# EAGLE design rev1 (EAGLE 7.3.0)
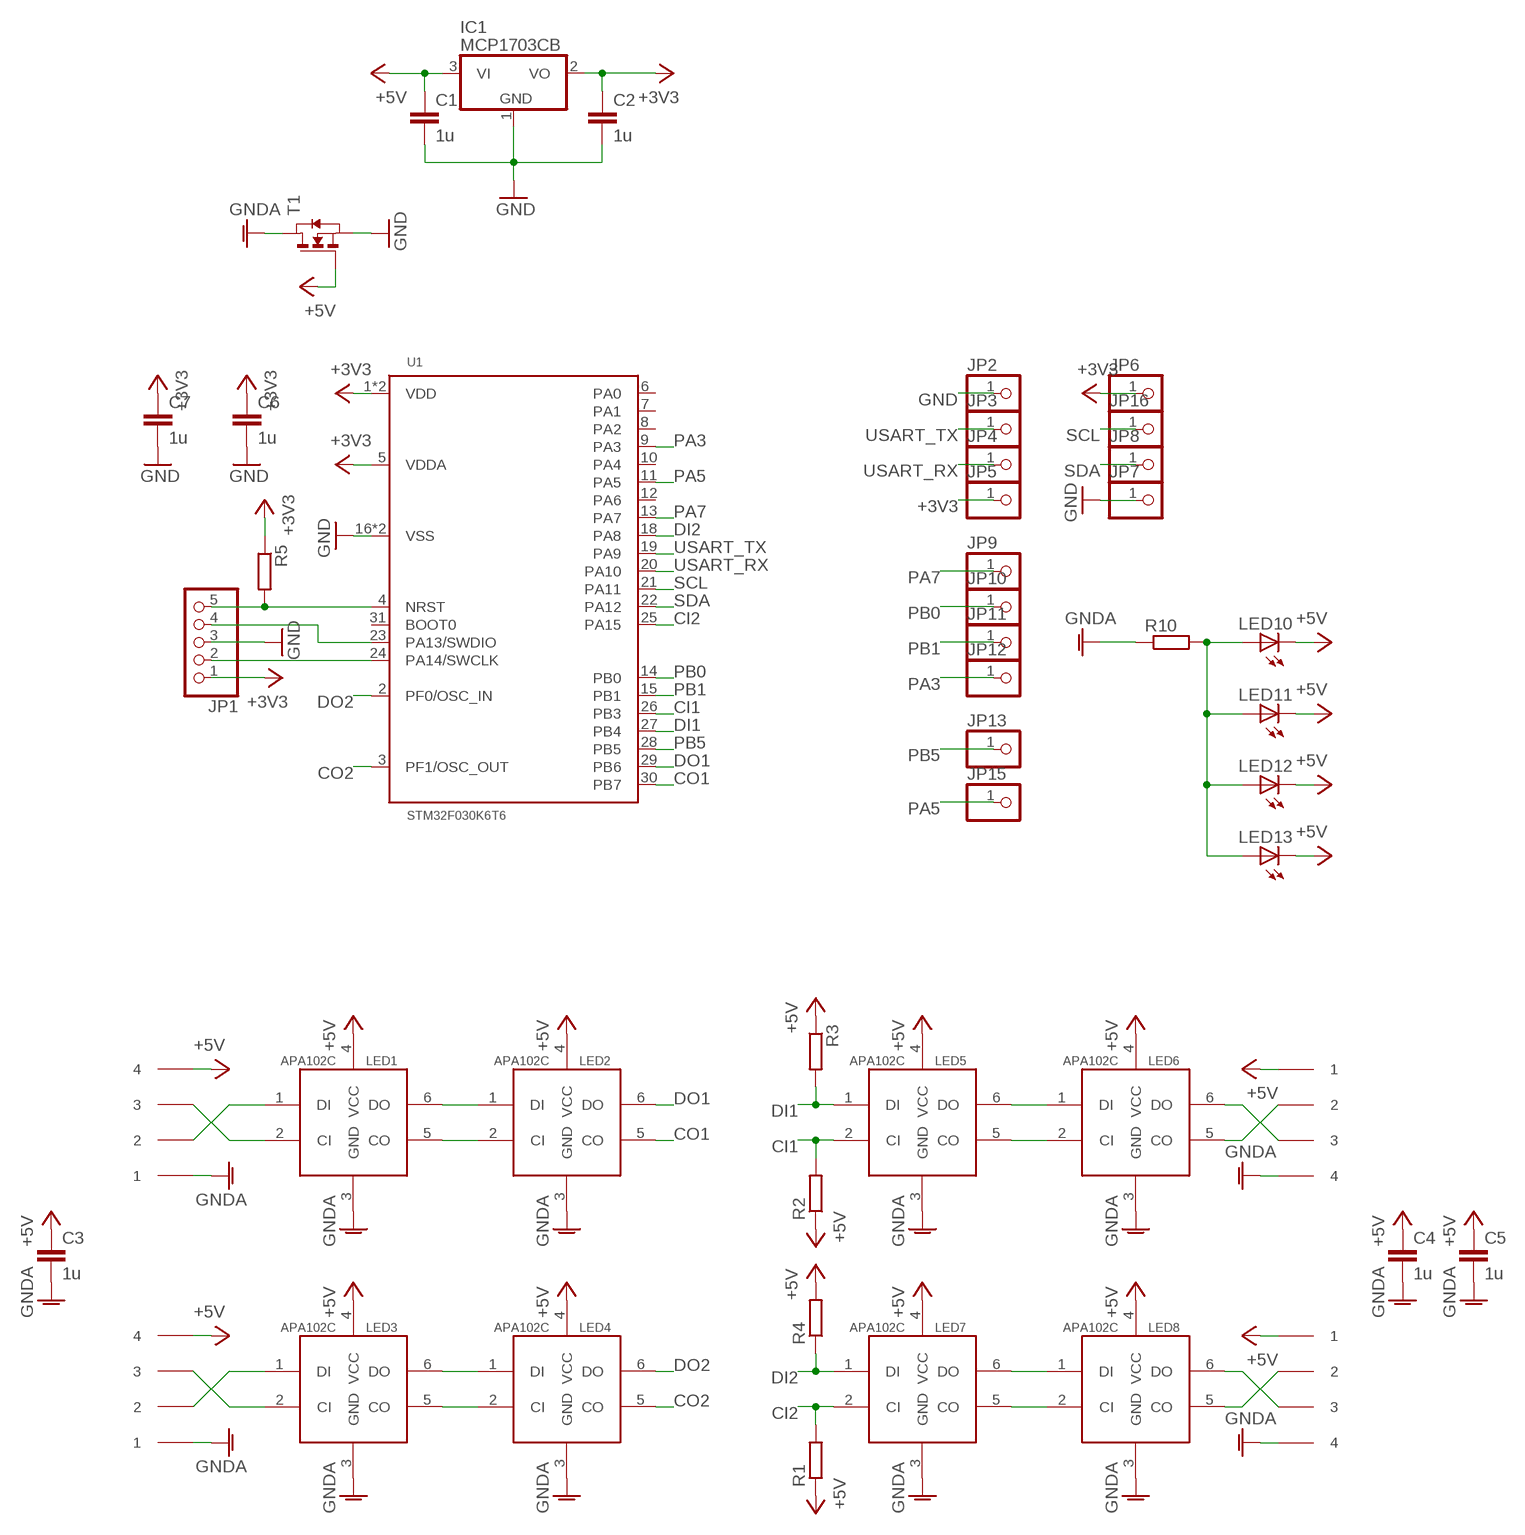
[diagram p0: schematic, sheet 1]

## Parts
C1  1u  CC0603  [C0603]
C2  1u  CC0603  [C0603]
C3  1u  CC0603  [C0603]
C4  1u  CC0603  [C0603]
C5  1u  CC0603  [C0603]
C6  1u  CC0603  [C0603]
C7  1u  CC0603  [C0603]
IC1  MCP1703CB  [SOT23]
JP1  PINHD-1X5  [1X05]
JP2  PINHD-1X1  [1X01]
JP3  PINHD-1X1  [1X01]
JP4  PINHD-1X1  [1X01]
JP5  PINHD-1X1  [1X01]
JP6  PINHD-1X1  [1X01]
JP7  PINHD-1X1  [1X01]
JP8  PINHD-1X1  [1X01]
JP9  PINHD-1X1  [1X01]
JP10  PINHD-1X1  [1X01]
JP11  PINHD-1X1  [1X01]
JP12  PINHD-1X1  [1X01]
JP13  PINHD-1X1  [1X01]
JP15  PINHD-1X1  [1X01]
JP16  PINHD-1X1  [1X01]
LED1  APA102C  [RGBLED5050]
LED2  APA102C  [RGBLED5050]
LED3  APA102C  [RGBLED5050]
LED4  APA102C  [RGBLED5050]
LED5  APA102C  [RGBLED5050]
LED6  APA102C  [RGBLED5050]
LED7  APA102C  [RGBLED5050]
LED8  APA102C  [RGBLED5050]
LED10  LEDSML0603  [SML0603]
LED11  LEDSML0603  [SML0603]
LED12  LEDSML0603  [SML0603]
LED13  LEDSML0603  [SML0603]
R1  RR0603  [R0603]
R2  RR0603  [R0603]
R3  RR0603  [R0603]
R4  RR0603  [R0603]
R5  RR0603  [R0603]
R10  RR0603  [R0603]
T1  NMOSSOT23-6  [SOT23-6]
U1  STM32F030K6T6  STM32F030K6T6-LQFP-32  [LQFP-32]
U$1  JSTPH  [JSTPH]
U$2  JSTPH  [JSTPH]
U$3  JSTPH  [JSTPH]
U$4  JSTPH  [JSTPH]

## Nets
+3V3: C2.1 C6.1 C7.1 IC1.2(VO) JP1.1 JP5.1 JP6.1 R5.1 U1.1(VDD) U1.5(VDDA) U1.17(VDD)
+5V: C1.1 C3.1 C4.1 C5.1 IC1.3(VI) LED1.4(VCC) LED2.4(VCC) LED3.4(VCC) LED4.4(VCC) LED5.4(VCC) LED6.4(VCC) LED7.4(VCC) LED8.4(VCC) LED10.C LED11.C LED12.C LED13.C R1.1 R2.1 R3.1 R4.2 T1.3(G) U$1.P$4 U$2.P$4 U$3.1 U$4.1
CI1: LED5.2(CI) R2.2 U1.26(PB3)
CI2: LED7.2(CI) R1.2 U1.25(PA15)
CI-CON1: LED1.2(CI) U$1.P$3
CI-CON2: LED3.2(CI) U$2.P$3
CO1: LED2.5(CO) U1.30(PB7)
CO2: LED4.5(CO) U1.3(PF1/OSC_OUT)
DI1: LED5.1(DI) R3.2 U1.27(PB4)
DI2: LED7.1(DI) R4.1 U1.18(PA8)
DI-CON1: LED1.1(DI) U$1.P$2
DI-CON2: LED3.1(DI) U$2.P$2
DO1: LED2.6(DO) U1.29(PB6)
DO2: LED4.6(DO) U1.2(PF0/OSC_IN)
GND: C1.2 C2.2 C6.2 C7.2 IC1.1(GND) JP1.3 JP2.1 JP7.1 T1.4(S) U1.16(VSS) U1.32(VSS)
GNDA: C3.2 C4.2 C5.2 LED1.3(GND) LED2.3(GND) LED3.3(GND) LED4.3(GND) LED5.3(GND) LED6.3(GND) LED7.3(GND) LED8.3(GND) R10.1 T1.1(D) T1.2(D) T1.5(D) T1.6(D) U$1.1 U$2.1 U$3.P$4 U$4.P$4
N$1: LED7.6(DO) LED8.1(DI)
N$2: LED7.5(CO) LED8.2(CI)
N$3: LED1.6(DO) LED2.1(DI)
N$4: LED1.5(CO) LED2.2(CI)
N$5: LED3.5(CO) LED4.2(CI)
N$6: LED3.6(DO) LED4.1(DI)
N$7: LED5.6(DO) LED6.1(DI)
N$8: LED5.5(CO) LED6.2(CI)
N$13: LED6.6(DO) U$4.P$3
N$14: LED6.5(CO) U$4.P$2
N$15: LED8.6(DO) U$3.P$3
N$16: LED8.5(CO) U$3.P$2
N$24: LED10.A LED11.A LED12.A LED13.A R10.2
NRST: JP1.5 R5.2 U1.4(NRST)
PA3: JP12.1 U1.9(PA3)
PA5: JP15.1 U1.11(PA5)
PA7: JP9.1 U1.13(PA7)
PB0: JP10.1 U1.14(PB0)
PB1: JP11.1 U1.15(PB1)
PB5: JP13.1 U1.28(PB5)
SCL: JP16.1 U1.21(PA11)
SDA: JP8.1 U1.22(PA12)
SWCLOCK: JP1.2 U1.24(PA14/SWCLK)
SWDIO: JP1.4 U1.23(PA13/SWDIO)
USART_RX: JP4.1 U1.20(PA10)
USART_TX: JP3.1 U1.19(PA9)
Unconnected: U1.6(PA0) U1.7(PA1) U1.8(PA2) U1.10(PA4) U1.12(PA6) U1.31(BOOT0)

## Library data of the parts
C1-C7 = eagle-ltspice:C: CAPACITOR, European symbol; SPICEMODEL: NONE; SPICEPREFIX: C
IC1 = linear:MCP1703: 250 mA, 16V, Low Quiescent Current LDO Regulator Source: http://ww1.microchip.com/downloads/en/DeviceDoc/22049b.pdf
JP1 = pinhead:PINHD-1X5: PIN HEADER
JP2-JP13 JP15 JP16 = pinhead:PINHD-1X1: PIN HEADER
LED1-LED8 = apa102c:APA102C
LED10-LED13 = led:LED: LED OSRAM: - CHIPLED LG R971, LG N971, LY N971, LG Q971, LY Q971, LO R971, LY R971 LH N974, LH R974 LS Q976, LO Q976, LY Q976 LO Q996 - Hyper CHIPLED LW Q18S LB Q993, LB Q99A, LB R99A - SideLED LS A670, LO A670, LY A670, LG A670, LP A670 LB A673, LV A673, LT A673, LW A673 LH A674 LY A675 LS A676, LA A676, LO A676, LY A676, LW A676 LS A679, LY A679, LG A679 - Hyper Micro SIDELED® LS Y876, LA Y876, LO Y876, LY Y876 LT Y87S - SmartLED LW L88C, LW L88S LB L89C, LB L89S, LG L890 LS L89K, LO L89K, LY L89K LS L896, LA L896, LO L896, LY L896 - TOPLED LS T670, LO T670, LY T670, LG T670, LP T670 LSG T670, LSP T670, LSY T670, LOP T670, LYG T670 LG T671, LOG T671, LSG T671 LB T673, LV T673, LT T673, LW T673 LH T674 LS T676, LA T676, LO T676, LY T676, LB T676, LH T676, LSB T676, LW T676 LB T67C, LV T67C, LT T67C, LS T67K, LO T67K, LY T67K, LW E67C LS E67B, LA E67B, LO E67B, LY E67B, LB E67C, LV E67C, LT E67C LW T67C LS T679, LY T679, LG T679 LS T770, LO T770, LY T770, LG T770, LP T770 LB T773, LV T773, LT T773, LW T773 LH T774 LS E675, LA E675, LY E675, LS T675 LS T776, LA T776, LO T776, LY T776, LB T776 LHGB T686 LT T68C, LB T68C - Hyper Mini TOPLED® LB M676 - Mini TOPLED Santana® LG M470 LS M47K, LO M47K, LY M47K Source: http://www.osram.convergy.de LUXEON: - LUMILED® LXK2-PW12-R00, LXK2-PW12-S00, LXK2-PW14-U00, LXK2-PW14-V00 LXK2-PM12-R00, LXK2-PM12-S00, LXK2-PM14-U00 LXK2-PE12-Q00, LXK2-PE12-R00, LXK2-PE12-S00, LXK2-PE14-T00, LXK2-PE14-U00 LXK2-PB12-K00, LXK2-PB12-L00, LXK2-PB12-M00, LXK2-PB14-N00, LXK2-PB14-P00, LXK2-PB14-Q00 LXK2-PR12-L00, LXK2-PR12-M00, LXK2-PR14-Q00, LXK2-PR14-R00 LXK2-PD12-Q00, LXK2-PD12-R00, LXK2-PD12-S00 LXK2-PH12-R00, LXK2-PH12-S00 LXK2-PL12-P00, LXK2-PL12-Q00, LXK2-PL12-R00 Source: www.luxeon.com KINGBRIGHT: KA-3528ASYC Source: www.kingbright.com
R1-R5 R10 = eagle-ltspice:R: RESISTOR, European symbol; SPICEMODEL: NONE; SPICEPREFIX: R
T1 = zetex:NMOSSOT23-6: MOS FET; OC_FARNELL: unknown; OC_NEWARK: unknown
U1 = STM32F030K6T6:STM32F030K6T6
U$1-U$4 = jst:JSTPH

## Board
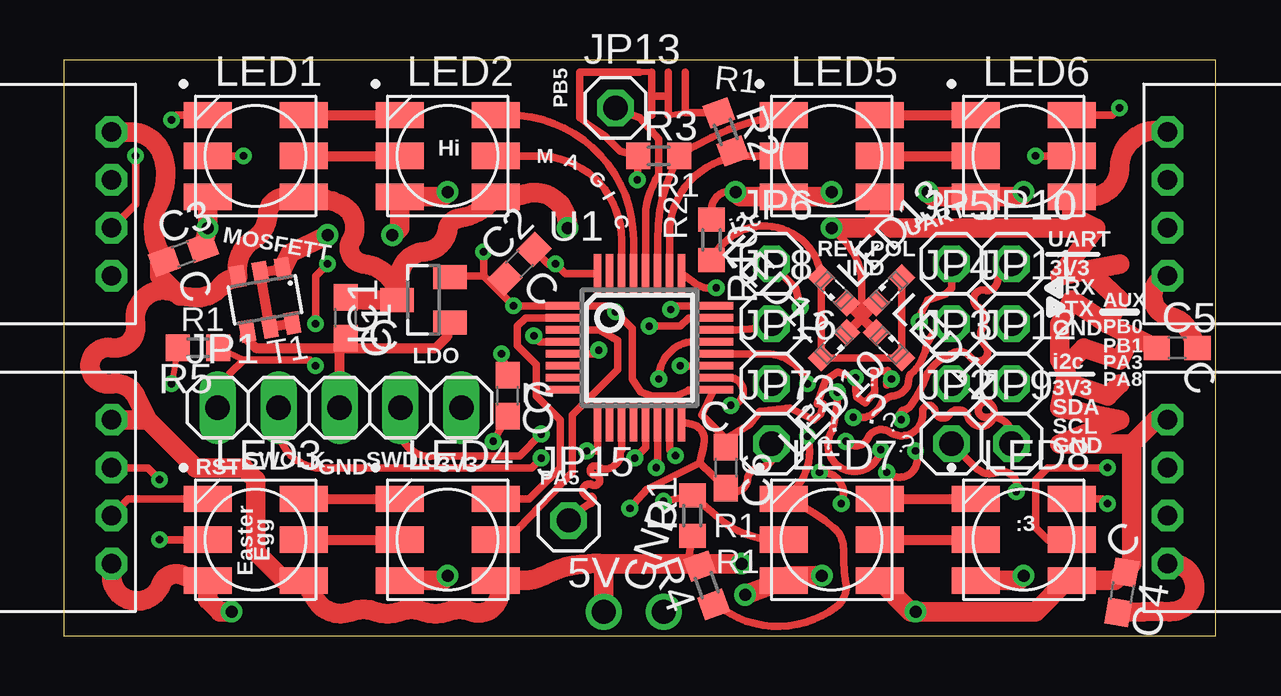
[diagram p1: board, top side]
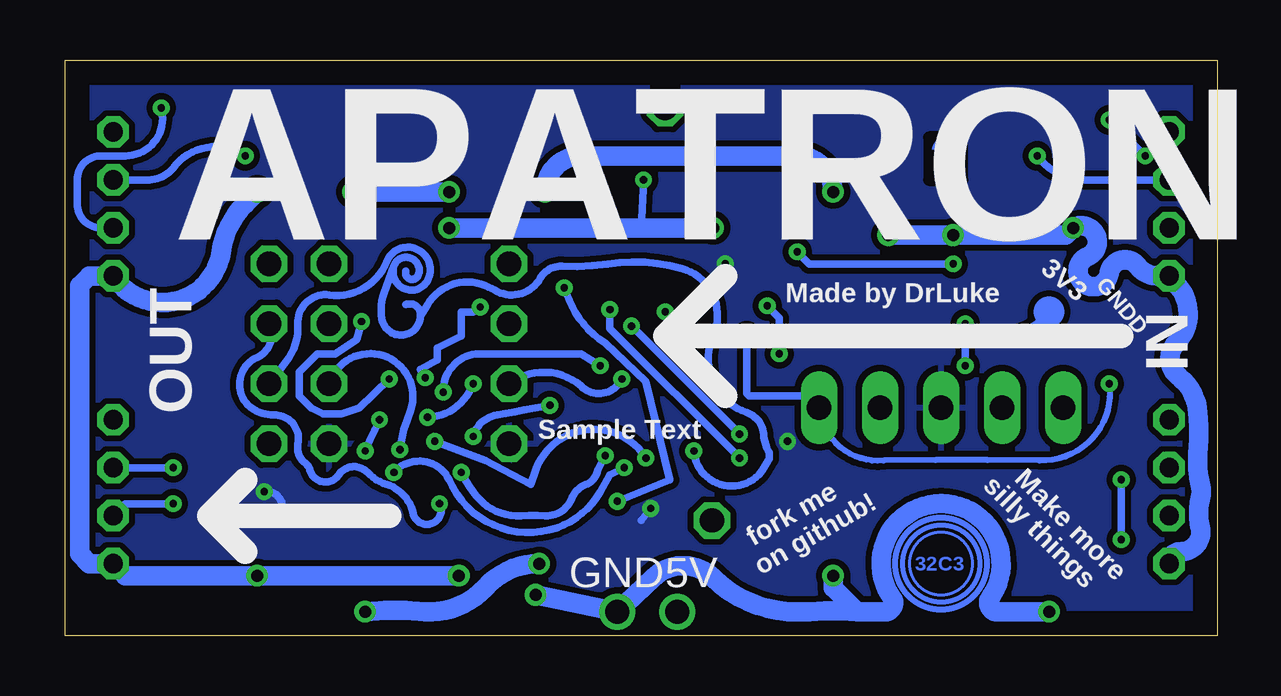
[diagram p2: board, bottom side, seen from below]

Size 48 x 24 mm. Coordinates in mm from the lower left corner, seen from the top.
Outline: 0,0 48,0 48,24 0,24 0,0
Copper layers (1*16): Top 0.035mm / dielectric 1.5mm / Bottom 0.035mm
Design rules "default": minimum track width 10mil, minimum drill 24mil, track to track 8mil, track to pad 8mil, pad to pad 8mil, via to via 8mil, smd to smd 8mil, copper to edge 40mil, drill to drill 8mil, minimum pad ring 10mil, minimum via ring 8mil, stop-mask expansion 4mil, vias tented up to drill 0mil, thermal gap 10mil

### Footprints (pad centres in the part's own frame; a part is rotated, then mirrored left to right if it is on the bottom)
C0603 = smd 1.1 x 1: 1 -0.85,0; 2 0.85,0
SOT23 = smd 1 x 1.4: 1 -0.95,-1.1; 2 0.95,-1.1; 3 0,1.1
1X05 = drill 1.016 long: 1 -5.08,0; 2 -2.54,0; 3 0,0; 4 2.54,0; 5 5.08,0
1X01 = drill 1.016 octagon: 1 0,0
RGBLED5050 = smd 2 x 1.1: 1 -2,1.7; 2 -2,0; 3 -2,-1.7; 4 2,-1.7; 5 2,0; 6 2,1.7
SML0603 = smd 0.8 x 0.8: A 0.75,0; C -0.75,0
R0603 = smd 1 x 1.1: 1 -0.85,0; 2 0.85,0
SOT23-6 = smd 0.6 x 0.9: 1 -0.95,-1.15; 2 0,-1.15; 3 0.95,-1.15; 4 0.95,1.15; 5 0,1.15; 6 -0.95,1.15
LQFP-32 = smd 0.3 x 1.6: 1 -1.75,-3.1; 2 -1.25,-3.1; 3 -0.75,-3.1; 4 -0.25,-3.1; 5 0.25,-3.1; 6 0.75,-3.1; 7 1.25,-3.1; 8 1.75,-3.1; 17 1.75,3.1; 18 1.25,3.1; 19 0.75,3.1; 20 0.25,3.1; 21 -0.25,3.1; 22 -0.75,3.1; 23 -1.25,3.1; 24 -1.75,3.1 | smd 1.6 x 0.3: 9 3.1,-1.75; 10 3.1,-1.25; 11 3.1,-0.75; 12 3.1,-0.25; 13 3.1,0.25; 14 3.1,0.75; 15 3.1,1.25; 16 3.1,1.75; 25 -3.1,1.75; 26 -3.1,1.25; 27 -3.1,0.75; 28 -3.1,0.25; 29 -3.1,-0.25; 30 -3.1,-0.75; 31 -3.1,-1.25; 32 -3.1,-1.75
JSTPH = drill 0.8 octagon: 1 -3,0; P$2 -1,0; P$3 1,0; P$4 3,0

### Placement (x,y rotation side)
C1  11.75,13.25 270 top
C2  19,15.5 45 top
C3  5,15.9 20 top
C4  44.1,1.8 260 top
C5  46.4,12 0 top
C6  27.6,7 270 top
C7  18.5,10 270 top
IC1  15,14 90 top
JP1  11.5,9.5 0 top
JP2  37,8 0 top
JP3  37,10.5 0 top
JP4  37,13 0 top
JP5  37,15.5 0 top
JP6  29.5,15.5 0 top
JP7  29.5,8 0 top
JP8  29.5,13 0 top
JP9  39.5,8 0 top
JP10  39.5,15.5 0 top
JP11  39.5,13 0 top
JP12  39.5,10.5 0 top
JP13  23,22 0 top
JP15  21.05,4.8 0 top
JP16  29.5,10.5 0 top
LED1  8,20 0 top
LED2  16,20 0 top
LED3  8,4 0 top
LED4  16,4 0 top
LED5  32,20 0 top
LED6  40,20 0 top
LED7  32,4 0 top
LED8  40,4 0 top
LED10  32.1,12.1 225 top
LED11  34.4,12.1 315 top
LED12  32.1,14.4 135 top
LED13  34.4,14.4 45 top
R1  26.2,5 90 top
R2  27.6,21 290 top
R3  24.8,20 0 top
R4  26.8,2.1 110 top
R5  5.6,12 180 top
R10  27,16.5 270 top
T1  8.4,14 190 top
U1  24,12 270 top
U$1  2,18 90 top
U$2  2,6 90 top
U$3  46,6 270 top
U$4  46,18 270 top

### Tracks (layer width: path | path; a pad name or v marks a point on that pad's centre or on a via)
+3V3  (via drill 0.3)
  Top 0.254: R5.1 7.5,11.5
  Top 0.305: IC1.2 16.15,15 17.5,15 | 17.5,15 18,14.5 | 18,14.5 v18.75,13.75 U1.1 22.75,13.75 v23,13.5 23.7,12.8 23.7,10.7 24.05,10.15 24.5,10 25.5,10 26,10.2 26.05,10.25 U1.17 26.6,9.2 27.6,8.2 | C2.1 18,14.5 | JP1.1 6.92,10.92 7.5,11.5 10.25,11.5 v10.5,11.25 | v10.5,13 10.5,15 v11,15.5 | v17.5,16 17.5,15 | v34.5,10.7 34.3,10.45 34.35,11.05 33.75,11 33.8,10.15 33.4,9.7 33.05,9.95 33,10.25 v33,10.75 32.25,11 31.75,10.65 31.4,9.65 31.65,9.65 31.55,9.25 31.25,9 30.25,9.5 29,9.35 28.6,8.8 27.6,8.2 | v35.65,13.1 35.75,13.5 36,14 36.75,14.25 37,14.5 JP5.1 | C6.1 27.6,8.2 | v30.7,13.7 30.5,14.5 JP6.1 | C7.1 v18.25,11.75 | U1.5 22.15,11.75 v22.3,11.9
  Bottom 0.305: v18.25,11.75 18.25,13.25 v18.75,13.75 | v10.5,11.25 10.5,12.5 | 10.5,12.5 v10.5,13 | v11,15.5 17,15.5 v17.5,16 | v34.5,10.7 35.75,9.5 36.5,9.25 37.25,9.25 37.75,9.5 38.25,10 38.25,11 37.5,11.75 36.75,11.75 35.85,12.35 v35.65,13.1 | v33,10.75 33.2,11.1 32.5,11.5 32.5,12 31.5,12.5 31.5,13.5 31,13.5 v30.7,13.7 | v22.3,11.9 22.3,12.8 v23,13.5 | 10.5,12.5 9,12.5 arc-53 7,13.5
+5V  (via drill 0.3, 0.5, 1)
  Top 0.254: 25.2,21.7 25.9,21.8 | 24.5,23.5 24,23.5
  Top 0.305: C1.1 12,14.5 | C3.1 4,16 | v32,17 32.5,16.5 arc-49 33.25,14.5 33.25,13.25 | R4.2 24,3 | v23.9,19 R3.1 23.2,20.2 22.6,20.8 22,21.2 21.5,21.6 21.5,23.5 24,23.5 | 24.5,23.5 24.5,22.5 | 24.5,22.5 24.5,21.7 | 24.5,22.5 25.2,22.5 | 25.2,22.5 25.2,23.5 | 25.9,23.5 25.9,21.8 R2.1 | 25.2,22.5 25.2,21.7 | R1.1 26,3
  Top 0.406: LED10.C 33.25,13.25 | 33.25,13.25 LED12.C | LED11.C 33.25,13.25 | 33.25,13.25 | 33.25,13.25 LED13.C
  Top 0.813: 4.75,14.25 4.85,14.15 5.5,14.1 arc52 6.5,14.5 arc-43 7.1,14.9 | 4.75,14.25 4,15 4,16 | 17.8,2.3 LED4.4 | LED7.4 35.3,1 v35.5,1 40.5,1 41.8,2.3 LED8.4 43.8,2.3 44,2.5 | 44,2.5 44.5,3 44.5,8 | 44.5,8 45.5,9 U$3.1 | U$2.P$4 3.5,9 | 3.5,9 5.5,7 7.5,7 8,6.5 8,3.5 9.2,2.3 LED3.4 10.5,1.5 arc79 12,1 arc-42 13,1 arc42 14,1 arc-42 15,1 arc42 16,1 arc-42 17,1 arc147 LED4.4 | LED5.4 34,17.5 | 34,17.5 34.5,17 43,17 | 43,17 42,17.5 LED6.4 42.8,18.3 arc90 44,19.5 arc-106 U$4.1 | v32,17 33.5,17 34,17.5 | 22.5,3 24,3 26,3 v28.25,3 | IC1.3 12.5,14 arc-15 C1.1 | IC1.3 14,14 arc77 12.5,15.5 arc-114 12,16.5 arc98 11.5,18 arc23 LED1.4 9.3,18.3 arc90 8.5,17.5 arc-53 7.9,16.5 arc69 T1.3 | v22.5,1 22.5,3 | C4.1 44,2.5 | IC1.3 14,15 arc-79 15,16 arc79 16,16.9 arc-79 16.5,17.4 arc45 LED2.4 18.6,18.3 arc19 19.2,18.4 arc-114 v21,17 | U$1.P$4 2.8,21 arc-69 4.1,20.1 arc-47 4,18.1 arc62 C3.1 | 3.5,9 3,10 arc74 2,10.5 arc-201 2,12 arc111 3,13 arc-130 4.75,14.25 | LED4.4 19.2,2.3 arc28 20,2.5 arc-27 21.9,3 arc-3 22.5,3 | 43,17 41.5,15 42.68,15.23 | 42.68,15.23 44,15.5 | 42.68,15.23 44,14 43.5,13 | 43.5,13 42,14 41.5,13 41.5,11.5 41.8,10.9 | 43.5,13 44.5,12.5 | 44.5,12.5 C5.1 | 44.5,12.5 44,11.5 42.5,12 42,11.5 | 41.8,10.9 42,10.5 43.5,10 44,10.5 | 44.5,8 41.5,8 44,9 41.5,9.5 41.8,10.9
  Bottom 0.305: v23.9,19 24,17
  Bottom 0.813: v21,17 24,17 v32,17 | v28.25,3 arc-48 30.5,2 arc52 33,1 arc-9 v35.5,1
CI1
  Top 0.305: U1.26 25.25,16.75 arc-90 28.5,20 | LED5.2 28.5,20 | R2.2 28.5,20
CI2  (via drill 0.3)
  Top 0.305: U1.25 26.3,14.7 arc47 v27.2,14.5 | v25,5.6 R1.2 27.3,4.9 arc45 LED7.2
  Bottom 0.305: v27.2,14.5 27,14 arc-36 25.5,12.2 23.8,10.6 22.8,6.5 v25,5.6
CI-CON1  (via drill 0.3)
  Top 0.305: v7.5,20 LED1.2
  Bottom 0.305: U$1.P$3 5.5,19 arc53 v7.5,20
CI-CON2  (via drill 0.3)
  Top 0.305: U$2.P$3 3.5,7 v4,6.5 | v4,4 LED3.2
  Bottom 0.305: v4,6.5 v4,4
CO1
  Top 0.305: U1.30 23.25,16.5 arc90 19.75,20 LED2.5
CO2
  Top 0.305: LED4.5 18.5,4 21.2,6.8 21.2,9.2 23.1,11.1 23.1,12.3 22.35,12.75 U1.3
DI1
  Top 0.305: U1.27 24.75,16.5 arc-29 R3.2 arc-10 26.3,20.4 arc-22 29.95,21.7 LED5.1
DI2  (via drill 0.3)
  Top 0.305: U1.18 27.8,10.75 arc-170 v27.8,9.6 | v31,8.3 arc-73 LED7.1 arc-23 32.1,4.5 arc-50 32.5,3.6 arc10 32.6,2.2 arc-62 32.2,1.2 arc-67 27.8,0.9 R4.1
  Bottom 0.305: v27.8,9.6 28.9,9.4 arc2 30,9.2 arc-65 v31,8.3
DI-CON1  (via drill 0.3)
  Top 0.305: U$1.P$2 3,18 v3,20 | v4.5,21.5 4.7,21.7 LED1.1
  Bottom 0.305: v3,20 v4.5,21.5
DI-CON2
  Top 0.305: U$2.P$2 2.7,5.7 LED3.1
DO1
  Top 0.305: U1.29 23.75,16.5 arc90 18.55,21.7 LED2.6
DO2
  Top 0.305: LED4.6 19.4,5.7 20.7,7 20.7,9 19.7,10 19.7,11.3 18.9,12.1 18.9,12.9 19.25,13.25 U1.2
GND  (via drill 0.3)
  Top 0.305: 11.75,12 11.5,12 11.75,12.25 C1.2 | IC1.1 16.15,13 | C2.2 20.2,15.5 v20.5,15.5 20.9,15.1 U1.32 | 26.5,7.2 C6.2 arc130 28.5,6.5 arc-82 29,7 arc119 JP7.1 | C7.2 v17.9,8.1 | U1.16 26.2,8.8 arc-84 26.7,8.1 arc-8 26.5,7.2 | 26.5,7.2 24.3,6.1 v23.6,5.3 | JP2.1 38,7 arc65 38.9,6.8 arc-130 v39.7,6
  Top 0.406: T1.4 7.55,12.45 8,12 11.5,12 | 11.5,12 15.5,12 16,12.5 16,12.95 IC1.1 | JP1.3 11.5,12
  Bottom 0.305: v23.6,5.3 24,4.8 | 39.6,4.7 arc-189 v39.7,6
  pour Bottom (isolate 0.254): 0,24 48,24 48,0 0,0
GNDA  (via drill 0.5, 1)
  Top 0.305: R10.1 27,17.75 arc-106 v28,18.5
  Top 0.406: T1.1 T1.2 T1.5 T1.6
  Top 0.813: T1.1 9.45,15.95 v11,16.7 | v13.7,16.7 14,17 LED2.3 15.8,18.3 v16,18.5 | v16,2.5 15.8,2.3 LED4.3 | v40,2.5 39.8,2.3 LED8.3 | v31.6,2.5 30.2,2.5 LED7.3 v28.4,1.7 | LED3.3 6,2 | 6,2 6,1.5 6.5,1 v7,1 | v36,18.5 36.2,18.3 LED6.3 39.8,18.3 arc90 v40,18.5 | v32,18.5 31.8,18.3 LED5.3 28.2,18.3 v28,18.5 | LED1.3 v6,17 C3.2 | C4.2 45,1 arc-4 46.1,1 arc190 U$3.P$4 | C5.2 46.9,12.7 arc53 46.1,13.3 arc-153 U$4.P$4 | U$2.1 2,2.5 arc152 4,2 4.1,2.2 arc-90 5,2.5 6,2
  Bottom 0.813: v13.7,16.7 v11,16.7 6.3,16.7 v6,17 arc187 5.4,15.8 arc-238 4.5,15.1 arc134 3.3,15.4 arc-53 2.5,15 U$1.1 | v31.6,2.5 v40,2.5 45.5,2.5 U$3.P$4 47,3 47.4,3.4 47.4,14.6 47,15 U$4.P$4 arc-139 41.5,16 arc37 40.5,18 v40,18.5 | 15,1 16,2 v16,2.5 | v36,18.5 v32,18.5 | v28.4,1.7 v25,1 23.5,2.4 arc90 21,2.4 arc-49 17,1 arc8 15,1 | v7,1 9,1 arc127 9.5,1.5 arc-254 13.5,1.5 arc127 14,1 15,1 | U$2.1 arc90 1.5,3.5 arc-103 0.7,4.5 arc25 0.7,5.7 arc-25 0.7,6.3 arc17 0.8,7.6 arc-8 0.8,9.3 arc-48 1.6,10.8 arc96 1.7,12.2 arc-101 2,14.9 | v16,18.5 arc-90 17.5,20 26.5,20 arc-90 v28,18.5
N$1
  Top 0.406: LED7.6 LED8.1
N$2
  Top 0.406: LED7.5 LED8.2
N$3
  Top 0.406: LED1.6 LED2.1
N$4
  Top 0.406: LED1.5 LED2.2
N$5
  Top 0.406: LED3.5 LED4.2
N$6
  Top 0.406: LED3.6 LED4.1
N$7
  Top 0.406: LED5.6 LED6.1
N$8
  Top 0.406: LED5.5 LED6.2
N$13  (via drill 0.3)
  Top 0.305: LED6.6 43.7,21.7 v44,22
  Bottom 0.305: U$4.P$3 46.5,17 arc90 47.5,18 47.5,19 arc90 46.5,20 45.5,20 arc-106 v44,22
N$14  (via drill 0.3)
  Top 0.305: LED6.5 v40.5,20
  Bottom 0.305: U$4.P$2 44.5,19 arc-53 43.5,19.5 arc87 v40.5,20
N$15  (via drill 0.3)
  Top 0.305: LED8.6 43.3,5.7 v43.5,5.5
  Bottom 0.305: v43.5,5.5 45.5,5.5 U$3.P$3
N$16  (via drill 0.3)
  Top 0.305: LED8.5 41,4 40.5,4.5 40.5,6.5 41,7 v43.5,7
  Bottom 0.305: v43.5,7 U$3.P$2
N$24
  Top 0.305: R10.2 arc-34 28,16.75 arc-115 LED12.A LED10.A LED11.A LED13.A
NRST  (via drill 0.3)
  Top 0.254: R5.2 v4.5,10.5
  Top 0.305: U1.4 19.85,12.25 v19.6,12.5
  Bottom 0.254: v4.5,10.5 arc100 7.4,7.3 arc-1 13.9,7.3 arc90 JP1.5
  Bottom 0.305: v19.6,12.5 19.6,10.1 19.5,10 17.08,10 JP1.5
PA3  (via drill 0.3)
  Top 0.305: v21.8,7.7 22.25,7.7 U1.9
  Bottom 0.305: JP12.1 38.8,11.4 arc-41 38.3,13 arc101 37,14.2 arc-76 34.6,15.6 arc187 32.9,14.8 arc169 34.3,15.4 | 34.3,15.4 arc188 33.3,15 arc172 33.8,15.2 | 34.3,15.4 34.7,14.3 arc-30 34.8,13.2 arc-168 33.2,13.3 | 33.2,13.3 32.9,13.8 arc81 30.5,14.6 arc9 30.1,14.4 arc-91 28.2,14.9 arc63 27.3,15.4 arc-11 25.4,15.5 arc24 22.3,15.3 arc99 21,12.5 arc-96 19.6,9.3 arc68 18.9,8.4 arc-24 18.7,7.7 arc56 18.7,7.3 arc12 19.1,6.7 arc131 v21.8,7.7 | 33.2,13.3 33.2,13.4 arc-113 33.8,13.8
PA5
  Top 0.305: JP15.1 arc-12 21.9,5.5 arc149 22,5.8 arc-221 22,6.3 arc221 22.1,6.7 arc-221 22.3,7 arc122 23.2,7.7 23.25,7.75 U1.11
PA7  (via drill 0.3)
  Top 0.305: v32.6,8.1 arc110 33.5,8.2 arc-100 34.4,8.5 arc132 35.8,9.3 arc-179 36.3,9.4 arc49 36.5,9.1 arc86 36.9,9.2 arc-133 37.7,9.1 arc209 38.6,9.7 arc221 38.5,9.1 arc-117 JP9.1 | v23.8,7.4 24.25,7.85 U1.13
  Bottom 0.305: v32.6,8.1 30.5,7.3 28.6,6.3 28.4,6.9 arc128 v23.8,7.4
PB0  (via drill 0.3)
  Top 0.305: v34.3,6.8 arc159 v35.5,7.7 | v34.9,9 arc-104 35,9.4 arc51 35.3,9.6 35.5,9.9 arc14 35.9,10.7 arc-29 36.3,11.3 arc-20 37.1,11.8 arc-76 37.8,11.6 arc187 38.4,12.1 arc-73 38.3,12.9 arc86 38.1,13.7 arc-161 38.4,14.4 arc89 38.9,14.7 arc-45 JP10.1 | U1.14 24.75,7.05 v24.7,7
  Bottom 0.305: v24.7,7 25.3,6.7 25.7,6 arc41 27.5,4.5 arc87 32,6.5 arc-112 v34.3,6.8 | v35.5,7.7 arc1 v34.9,9
PB1  (via drill 0.3)
  Top 0.305: v31.5,6.8 arc-125 v32.4,5.5 | U1.15 25.25,7.75 v25.5,7.5
  Bottom 0.305: v25.5,7.5 25.8,6.9 arc57 26.3,6.3 arc-47 26.9,5.7 arc72 28,5 arc-7 29,5 arc60 31,6 arc3 v31.5,6.8 | v32.4,5.5 arc196 33.5,5.1 arc-61 34.6,6.3 arc30 35.4,6.8 arc-103 36.6,6.7 arc132 37.8,6.9 arc-38 38,7.2 arc64 38.3,8 arc-103 39.3,9.2 arc31 40.1,9.4 arc127 40,11.6 arc-92 JP11.1
PB5
  Top 0.305: U1.28 24.25,17.5 arc-32 24.8,19.2 24.8,20.7 24,21.6 arc-11 JP13.1
SCL  (via drill 0.3)
  Top 0.305: U1.21 26.1,12.25 arc80 v24.8,10.7
  Bottom 0.305: JP16.1 arc77 26.5,10.4 arc-109 v24.8,10.7
SDA
  Top 0.305: U1.22 28,12.75 arc19 JP8.1
SWCLOCK  (via drill 0.3)
  Top 0.305: JP1.2 8.96,8.54 arc90 11,7 19.5,7 v19.9,7.4 | v25.3,13.6 25.45,13.75 U1.24
  Bottom 0.305: v19.9,7.4 25.3,12.8 v25.3,13.6
SWDIO  (via drill 0.3)
  Top 0.305: JP1.4 14.04,8.46 arc90 15.5,7.5 19,7.5 v19.9,8.4 | v24.4,12.9 25.7,12.9 26.05,13.25 U1.23
  Bottom 0.305: v19.9,8.4 v24.4,12.9
USART_RX  (via drill 0.3)
  Top 0.305: U1.20 29.25,11.75 arc-71 v31,10.5 | JP4.1 arc73 35.9,11.85 arc-34 35.3,10.9 arc29 35.2,10.5 arc-65 34.6,10 arc44 34.1,9.7 arc-53 33.4,9.1 v32.9,9.1
  Bottom 0.305: v31,10.5 arc68 v32.9,9.1
USART_TX  (via drill 0.3)
  Top 0.305: U1.19 v25.7,11.25 | v32.25,10.15 arc-16 32,8.5 arc200 v34.05,7.75
  Bottom 0.305: v25.7,11.25 26.5,11.75 30.75,11.75 arc-90 v32.25,10.15 | v34.05,7.75 arc15 33.6,9.4 arc-181 JP3.1
(copper drawn outside any net)
  shapes: Bottom circle x4

### Text on the board
Bottom: ? | 32C3
tPlace: R1 | PB5 | Hi | M | A | G | R1 | I | C | i2c | UART | MOSFETT | R2 | REV.POL | UART | IND | 3V3 | C | R1 | C | RX | AUX | TX | PB0 | C | LDO | GND | PB1 | i2c | PA3 | C | ? | ? | 3V3 | PA8 | C | ? | ? | SDA | C | ? | ? | ? | GND | SCL | RST | SWCLK | GND | SWDIO | 3V3 | PA5 | ? | R1 | :3 | C | R1 | Egg | Easter | 5V | GND
bPlace: APATRON | GNDD | 3V3 | IN | Made by DrLuke | OUT | Sample Text | Make more | silly things | fork me / on github! | 5V | GND